# Altium project PIC_16F887A_Cam.PrjPCB
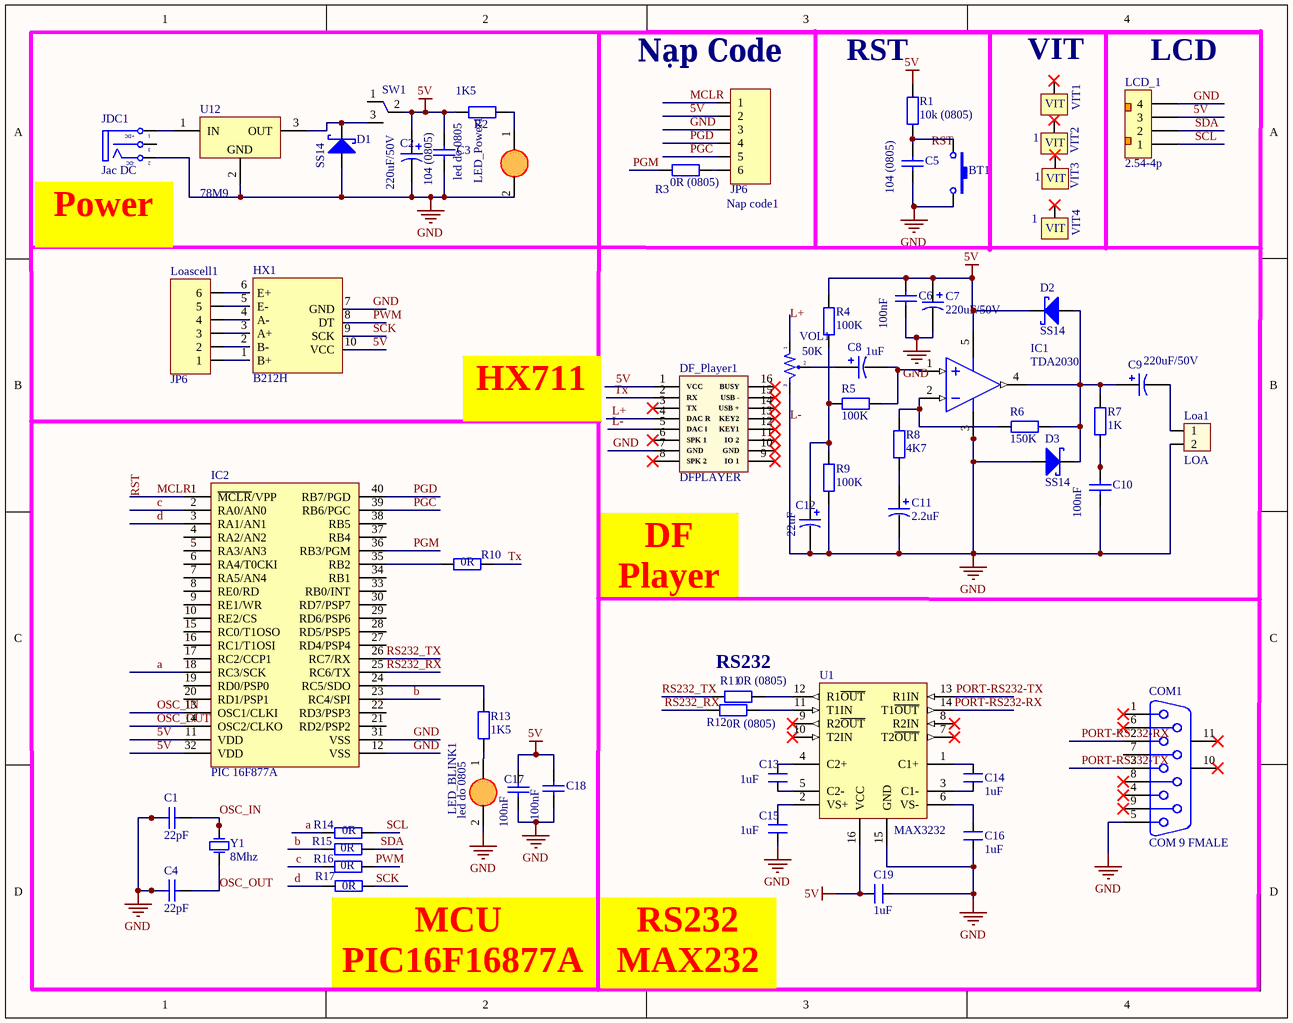
[diagram p0: Sheet1.SchDoc]
1 sheet, 61 parts. Net scope: global (net labels, ports and power ports of the same name join across sheets).
Board file: PCB1.PcbDoc

## Sheet Sheet1.SchDoc
size A

### Parts
BT1  Nút Nhấn 2 Chân 3x6x2.5MM SMD  [SW2-DIP]  (value not drawn)
C1  22pF  [CN1.5]
C2  220uF/50V  [CP1.5/3.4]
C3  104 (0805)  [CN1.5]
C4  22pF  [CN1.5]
C5  104 (0805)  [CN1.5]
C6  100nF  [CN1.5]
C7  220uF/50V  [CP1.5/3.4]
C8  1uF  [CP1/2]
C9  220uF/50V  [CP1.5/3.4]
C10  100nF  [CN1.5]
C11  2.2uF  [CP1/2]
C12  22uF  [CP1/2]
C13  1uF  [CN1.5]
C14  1uF  [CN1.5]
C15  1uF  [CN1.5]
C16  1uF  [CN1.5]
C17  100nF  [CN1.5]
C18  100nF  [CN1.5]
C19  1uF  [CN1.5]
COM1  COM 9 FMALE  [DSB 9-F]
D1  SS14  [DIO-1A]
D2  SS14  [DIO-1A]
D3  SS14  [DIO-1A]
DF_Player1  DFPLAYER  [DFPLAYER]
HX1  B212H  [Module_HX711]
IC1  TDA2030  [DIP5SL1]
IC2  PIC 16F877A  [DIP40/W0.6]
JDC1  Jac DC  [DC-IN]
LCD_1  2.54-4p  [Header Duc Thang 4p 2.54]
LED_BLINK1  led do 0805  [LED-5-Green]
LED_Power1  led do 0805  [LED-5-Green]
Loa1  LOA  [CON2]
Loascell1  JP6  [HDR6]
Nap_code1  JP6  [JP6-D1T]
R1  10k (0805)  [RES-1/4W]
R2  1K5  [RES-1/4W]
R3  0R (0805)  [RES-1/4W]
R4  100K  [RES-1/4W]
R5  100K  [RES-1/4W]
R6  150K  [RES-1/4W]
R7  1K  [RES-1/4W]
R8  4K7  [RES-1/4W]
R9  100K  [RES-1/4W]
R10  0R  [RES-1/4W]
R11  0R (0805)  [RES-1/4W]
R12  0R (0805)  [RES-1/4W]
R13  1K5  [RES-1/4W]
R14  0R  [RES-1/4W]
R15  0R  [RES-1/4W]
R16  0R  [RES-1/4W]
R17  0R  [RES-1/4W]
SW1  Switch  [JP3-C1T]  (value not drawn)
U1  MAX3232  [DIP16]
U12  78M9  [HDR1x3 BIG]
VIT1  1  [VIT]
VIT2  1  [VIT]
VIT3  1  [VIT]
VIT4  1  [VIT]
VOL1  50K  [VOL-D]
Y1  8Mhz  [THACH ANH CAM]

### Nets
5V: C2.1 C3.1 C6.1 C7.1 C17.1 C18.1 C19.1 D2.2(K) DF_Player1.1(VCC) HX1.10(VCC) IC1.5(V+) IC2.11(VDD) IC2.32(VDD) LCD_1.3 Nap_code1.2 R1.2 R2.1 R4.1 SW1.2 U1.16(VCC)
GND: BT1.2 C1.2 C2.2 C3.2 C4.2 C5.2 C6.2 C7.2 C10.2 C11.2 C12.2 C15.2 C16.2 C17.2 C18.2 C19.2 COM1.5 D1.1(A) D3.1(A) DF_Player1.5(DAC_l) DF_Player1.7(GND) HX1.7(GND) IC1.3(V-) IC2.12(VSS) IC2.31(VSS) JDC1.2(TN) LCD_1.4 LED_BLINK1.2(K) LED_Power1.2(K) Loa1.2 Nap_code1.3 R9.2 U1.15(GND) U12.2(GND) VOL1.3  [also labelled L-]
a: IC2.18(RC3/SCK) R14.1
b: IC2.23(RC4/SPI) R15.1
c: IC2.2(RA0/AN0) R16.1
d: IC2.3(RA1/AN1) R17.2
L+: DF_Player1.4(DAC_R) VOL1.1
MCLR: IC2.1(~{MCLR}/VPP) Nap_code1.1  [also labelled RST]
OSC_IN: C1.1 IC2.13(OSC1/CLKI) Y1.1(OSC1)
OSC_OUT: C4.1 IC2.14(OSC2/CLKO) Y1.2(OSC2)
PGC: IC2.39(RB6/PGC) Nap_code1.5
PGD: IC2.40(RB7/PGD) Nap_code1.4
PGM: IC2.36(RB3/PGM) R3.1
PORT-RS232-RX: COM1.2 U1.14(T1~{OUT})
PORT-RS232-TX: COM1.3 U1.13(R1IN)
PWM: HX1.8(DT) R16.2
RS232_RX: IC2.25(RC6/TX) R12.1
RS232_TX: IC2.26(RC7/RX) R11.1
SCK: HX1.9(SCK) R17.1
SCL: LCD_1.1 R14.2
SDA: LCD_1.2 R15.2
Tx: DF_Player1.2(RX) R10.2
NetBT1_1: BT1.1 C5.1 R1.1
NetC8_1: C8.1 VOL1.2
NetC8_2: C8.2 IC1.1(IN+) R5.1
NetC9_1: C9.1 D2.1(A) D3.2(K) IC1.4(OUT) R6.1 R7.1
NetC9_2: C9.2 Loa1.1
NetC10_1: C10.1 R7.2
NetC11_1: C11.1 R8.2
NetC12_1: C12.1 R4.2 R5.2 R9.1
NetC13_1: C13.1 U1.4(C2+)
NetC13_2: C13.2 U1.5(C2-)
NetC14_1: C14.1 U1.1(C1+)
NetC14_2: C14.2 U1.3(C1-)
NetC15_1: C15.1 U1.2(VS+)
NetC16_1: C16.1 U1.6(VS-)
NetD1_2: D1.2(K) SW1.3 U12.3(OUT)
NetHX1_1: HX1.1(B+) Loascell1.1
NetHX1_2: HX1.2(B-) Loascell1.2
NetHX1_3: HX1.3(A+) Loascell1.3
NetHX1_4: HX1.4(A-) Loascell1.4
NetHX1_5: HX1.5(E-) Loascell1.5
NetHX1_6: HX1.6(E+) Loascell1.6
NetIC1_2: IC1.2(IN-) R6.2 R8.1
NetIC2_24: IC2.24(RC5/SDO) R13.2
NetIC2_35: IC2.35(RB2) R10.1
NetJDC1_1: JDC1.1(T) U12.1(IN)
NetLED_BLINK1_1: LED_BLINK1.1(A) R13.1
NetLED_Power1_1: LED_Power1.1(A) R2.2
NetNap_code1_6: Nap_code1.6 R3.2
NetR11_2: R11.2 U1.12(R1~{OUT})
NetR12_2: R12.2 U1.11(T1IN)

Not connected (* = marked no-connect by the designer): COM1 1* 4* 6* 7 8* 9* 10(MH1)* 11(MH2)*; DF_Player1 3(TX)* 6(SPK_1)* 8(SPK_2)* 9(IO_1)* 10(GND)* 11(IO_2)* 12(KEY1)* 13(KEY2)* 14(USB_+)* 15(USB_-)* 16(BUSY)*; IC2 4(RA2/AN2) 5(RA3/AN3) 6(RA4/T0CKI) 7(RA5/AN4) 8(RE0/RD) 9(RE1/WR) 10(RE2/CS) 15(RC0/T1OSO) 16(RC1/T1OSI) 17(RC2/CCP1) 19(RD0/PSP0) 20(RD1/PSP1) 21(RD2/PSP2) 22(RD3/PSP3) 27(RD4/PSP4) 28(RD5/PSP5) 29(RD6/PSP6) 30(RD7/PSP7) 33(RB0/INT) 34(RB1) 37(RB4) 38(RB5); JDC1 3(S); SW1 1; U1 7(T2~{OUT})* 8(R2IN)* 9(R2~{OUT})* 10(T2IN)*; VIT1 VIT1(1)*; VIT2 VIT1(1)*; VIT3 VIT1(1)*; VIT4 VIT1(1)*

### Notes on the sheet
- (near Nap_code1) Nạp Code
- (near R1) RST
- (near VIT1) VIT
- (near LCD_1) LCD
- Power
- HX711
- DF Player
- RS232
- (near R17) MCU
  PIC16F16877A
- RS232
  MAX232
- Labels drawn without touching a wire or pin: RST
- (in symbol DCIN) +DC; -DC

### Library data of the parts
BT1 = Nut Nhan 2 Chan SMD: Dán; Don_Vi: Con; So_Chan: 2; Ma_Hang: MH001036; Kieu_Chan: *; Ten_Linh_Kien: Nút Nhấn 2 Chân 3x6x2.5MM SMD; Chung_Loai: Dán
C1 C3-C6 C10 C17 C18 = Tu 0805 104 50V 10%: Dán; Don_Vi: Con; So_Chan: 2; Ten_Linh_Kien: Tụ 0805 104-100nF 10% 50V; Ma_Hang: MH004551; Chung_Loai: Dán; Kieu_Chan: *
C2 C7 C9 = EEE-FK1C681P: CAP ALUM 680uF 20% 16V SMD; MFR: Panasonic; Value: 680uF/16V; Solder: SMT; MPN: EEE-FK1C681P; Category: CAPACITOR; PinCount: 2
C8 C11 C12 = EEE-1HA470XP: CAP ALUM 47uF 20% 50V SMD; Value: 476/50V; CompanyID: VT-00558; Solder: SMT; MPN: EEE-1HA470XP; Category: CAPACITOR; PinCount: 2
C13-C16 C19 = CAP-CER/100nF/50V/X7R/0805: CAP CER 0.1UF 50V X7R 0805; Manufacturer: AVX Corporation; Manufacturer Part Number: 08055C104KAT2A; Capacitance: 0.10µF; Tolerance: ±10%; Supplier 1: Digi-Key; RoHS: RoHS Compliant; Category: Capacitors; Stock 1: 6127704; Pricing 1: 1=0.1, 10=0.036, 100=0.0165, 250=0.01352, 500=0.01156, 1000=0.009 (USD); Packaging: Cut Tape (CT); Voltage - Rated: 50V; Temperature Coefficient: X7R; Mounting Type: Surface Mount, MLCC; Operating Temperature: -55°C ~ 125°C; Applications: General Purpose; Ratings: -; Package / Case: 0805 (2012 Metric); Size / Dimension: 0.079" L x 0.049" W (2.01mm x 1.25mm); Height - Seated (Max): -; Thickness (Max): 0.037" (0.94mm); Lead Spacing: -; Features: -; Lead Style: -; ComponentLink1URL: http://datasheets.avx.com/X7RDielectric.pdf; ComponentLink1Description: http://datasheets.avx.com/X7RDielectric.pdf; Supplier Part Number 1: 478-1395-1-ND
COM1 = DSB9F: COM 9; PackageDocument: O; Positions: 9; Gender: Receptacle; Value: COM 9; Published: 15-Jun-2001; LatestRevisionDate: 17-Jul-2002; LatestRevisionNote: Re-released for DXP Platform.; DatasheetDocument: 1-Sep-1999; PackageReference: 788750; Publisher: Altium Limited; Orientation: Right Angle
D1-D3 = Diode SS14 ( 1N5819): Dán; Ma_Hang: MH002211; Don_Vi: Con; So_Chan: 2; Kieu_Chan: DO214; Ten_Linh_Kien: Diode SS14 DO214 Schottky 1A 40V ( 1N5819 DO214); Chung_Loai: Dán
HX1 = Module_HX711
IC1 = TDA2030: 14W Hi-Fi AUDIO AMPLIFIER; Value: TDA2030
IC2 = PIC16F877-PU: 8K FLASH, 368B RAM, 256B EFROM; Value: DIP 40; Value: PIC16F877A; Copyright by: VanDungEvn
JDC1 = DCIN: Jac DC input; Value: Jac DC
LCD_1 = Header 2.54_4p Duc Thang: Cắm; Don_Vi: Con; So_Chan: 4; Ten_Linh_Kien: Header 4P XH2.54-4P Đực Thẳng; Ma_Hang: MH001285; Chung_Loai: Cắm; Kieu_Chan: *
LED_BLINK1 LED_Power1 = Led 0805 Do: Dán; Don_Vi: Con; So_Chan: 2; Ten_Linh_Kien: LED 0805 Màu Đỏ; Ma_Hang: MH000897; Chung_Loai: Dán; Kieu_Chan: *
Loa1 = Header 2 2.54mm: Header 2.54mm Through Hole; Manufacturer: TE Connectivity AMP Connectors; Manufacturer Part Number: 640456-2; Cost (VNĐ): 1500; Pitch - Mating: 0.100" (2.54mm); Shrouding: Unshrouded; Number of Positions: 2; Number of Positions Loaded: All; Contact Length - Mating: 0.295" (7.49mm); Value: Header 2.54mm; BuyLink: http://www.tme.vn/Product.aspx?id=857#page=pro_info; Supplier 1: Digi-Key; RoHS: RoHS Compliant; Category: Connectors, Interconnects; Stock 1: 127087; Pricing 1: 1=0.12, 10=0.117, 50=0.0748, 100=0.0724, 250=0.0624, 500=0.05992, 1000=0.05243, 2500=0.04744 (USD); Packaging: Bulk; Part Status: Active; Connector Type: Header; Contact Type: Male Pin; Number of Rows: 1; Row Spacing - Mating: -; Mounting Type: Through Hole; Termination: Solder; Fastening Type: Friction Lock; Contact Finish - Mating: Tin; Contact Finish Thickness - Mating: -; Features: -; Insulation Color: Natural; ComponentLink1URL: http://www.te.com/commerce/DocumentDelivery/DDEController?Action=srchrtrv&DocNm=640456&DocType=Customer+Drawing&DocLang=English; ComponentLink1Description: http://www.te.com/commerce/DocumentDelivery/DDEController?Action=srchrtrv&DocNm=640456&DocType=Customer+Drawing&DocLang=English; Supplier Part Number 1: A1921-ND
Loascell1 Nap_code1 = JP6: WR-PHD 2.54 mm Angled Socket Header; Manufacturer: W¨¹rth Elektronik eiSos GmbH; partNo: 613006143121; ComponentLink1 Description: Manufacturer; ComponentLink2 Description: Datasheet; NoPins: 06; Created Date: 29 March 2013; ComponentLink1URL: http://www.we-online.com; ComponentLink2URL: http://katalog.we-online.de/em/datasheet/6130xx143121.pdf; Created by: Karrer Zheng
R1 R4-R9 = Tro 0805 5% 10k: Dán; Don_Vi: Con; So_Chan: 2; Ten_Linh_Kien: Trở 0805 5% 10k; Ma_Hang: MH005239; Chung_Loai: Dán; Kieu_Chan: *
R2 R3 R10-R17 = Tro 0805 5% 470R: Dán; Don_Vi: Con; Ma_Hang: MH005341; Ten_Linh_Kien: Trở 0805 5% 470R; So_Chan: 2; Chung_Loai: Dán; Kieu_Chan: *
U1 = MAX232: RS232 LEVEL SHIFTER; Manufacturer Part Number: MAX232DR; Manufacturer: Texas Instruments; Number of Drivers/Receivers: 2/2; Voltage - Supply: 4.5 V ~ 5.5 V; Supplier 1: Digi-Key; Supplier Part Number 1: 296-14619-1-ND; RoHS: RoHS Compliant; Packaging: Cut Tape (CT); Protocol: RS232; Type: Transceiver; Supplier Part Number: 296-14619-1-ND; Supplier: Digi-Key; Category: Integrated Circuits (ICs); Package / Case: 16-SOIC (3.9mm Width)
U12 = 7809: Dán; Ten_Linh_Kien: 78M09 TO252; Don_Vi: Con; Ma_Hang: MH004847; Ghi_Chu: *; Kieu_Chan: *; Chung_Loai: Dán
VIT1-VIT4 = VIT: Oc Vit
VOL1 = VOL-S: Var Resistor; Value: Volume 50k
Y1 = Thach Anh 7.3728Mhz 49s SMD: Dán; Ten_Linh_Kien: Thạch Anh 7.3728Mhz 49S SMD; Ma_Hang: MH002129; Don_Vi: Con; Chung_Loai: Dán